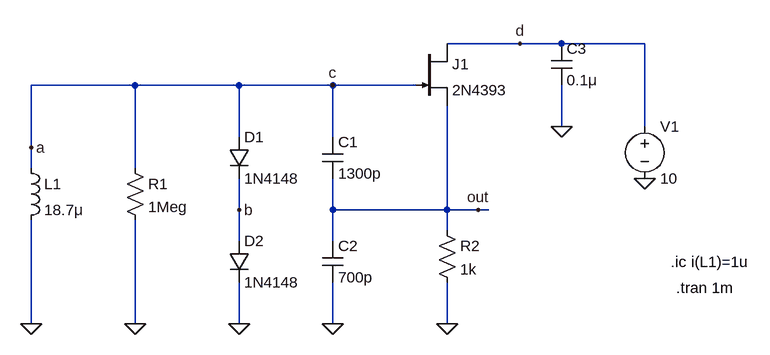
[diagram p0: schematic Colpitts oscillator.asc]
Colpitts oscillator.asc, the LTspice schematic file:
Version 4
SHEET 1 880 680
WIRE 160 -16 48 -16
WIRE 224 -16 160 -16
WIRE 352 -16 224 -16
WIRE -432 48 -592 48
WIRE -272 48 -432 48
WIRE -128 48 -272 48
WIRE 0 48 -128 48
WIRE 224 112 224 48
WIRE 352 112 352 -16
WIRE -272 128 -272 48
WIRE -128 128 -128 48
WIRE -592 144 -592 48
WIRE -592 176 -592 144
WIRE -432 176 -432 48
WIRE -272 240 -272 192
WIRE -128 240 -128 192
WIRE 48 240 48 80
WIRE 48 240 -128 240
WIRE 96 240 48 240
WIRE 112 240 96 240
WIRE 48 272 48 240
WIRE -272 288 -272 240
WIRE -128 288 -128 240
WIRE -592 416 -592 256
WIRE -432 416 -432 256
WIRE -272 416 -272 352
WIRE -128 416 -128 352
WIRE 48 416 48 352
FLAG 48 416 0
FLAG 224 112 0
FLAG -128 416 0
FLAG -272 416 0
FLAG -432 416 0
FLAG -592 416 0
FLAG 352 192 0
FLAG 96 240 out
FLAG -272 240 b
FLAG -128 48 c
FLAG -592 144 a
FLAG 160 -16 d
SYMBOL voltage 352 96 R0
WINDOW 123 0 0 Left 0
WINDOW 39 0 0 Left 0
SYMATTR InstName V1
SYMATTR Value 10
SYMBOL cap 208 -16 R0
SYMATTR InstName C3
SYMATTR Value 0.1μ
SYMBOL njf 0 -16 R0
SYMATTR InstName J1
SYMATTR Value 2N4393
SYMBOL res 32 256 R0
SYMATTR InstName R2
SYMATTR Value 1k
SYMBOL cap -144 288 R0
SYMATTR InstName C2
SYMATTR Value 700p
SYMBOL cap -144 128 R0
SYMATTR InstName C1
SYMATTR Value 1300p
SYMBOL diode -288 128 R0
SYMATTR InstName D1
SYMATTR Value 1N4148
SYMBOL diode -288 288 R0
SYMATTR InstName D2
SYMATTR Value 1N4148
SYMBOL res -448 160 R0
SYMATTR InstName R1
SYMATTR Value 1Meg
SYMBOL ind -608 160 R0
SYMATTR InstName L1
SYMATTR Value 18.7μ
TEXT 392 320 Left 2 !.ic i(L1)=1u
TEXT 400 360 Left 2 !.tran 1m

The netlist it stands for:
* Colpitts oscillator.asc
V1 d 0 10
C3 d 0 0.1μ
J1 d a out 2N4393
R2 out 0 1k
C2 out 0 700p
C1 a out 1300p
D1 a b 1N4148
D2 b 0 1N4148
R1 a 0 1Meg
L1 a 0 18.7μ
.model D D
.lib standard.dio
.model NJF NJF
.model PJF PJF
.lib standard.jft
.ic i(L1)=1u
.tran 1m
.backanno
.end